# EAGLE design console (EAGLE 9.3.0)
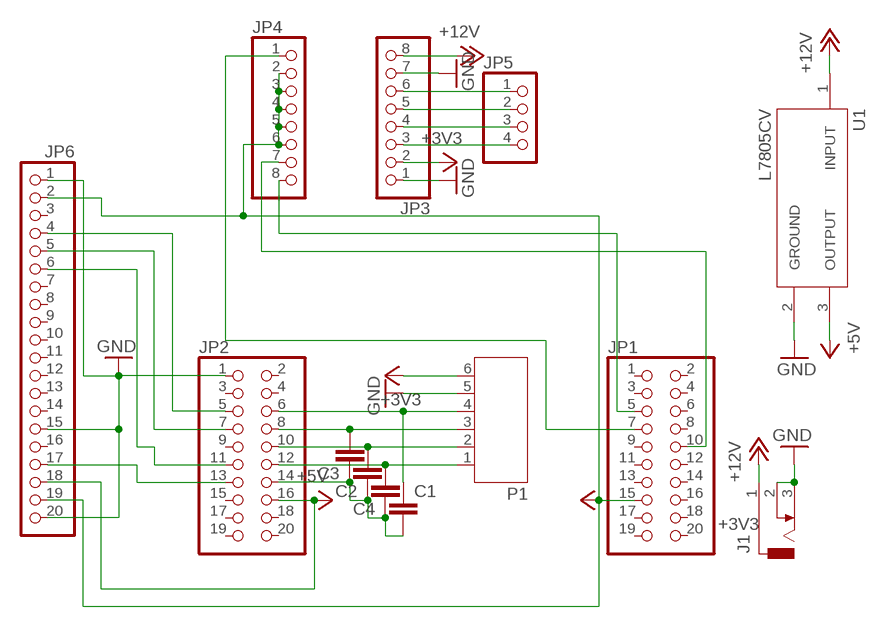
[diagram p0: schematic, sheet 1]

## Parts
C1  C-EU025-030X050  [C025-030X050]
C2  C-EU025-030X050  [C025-030X050]
C3  C-EU025-030X050  [C025-030X050]
C4  C-EU025-030X050  [C025-030X050]
J1  DCJ0303  [DCJ0303]
JP1  PINHD-2X10  [2X10]
JP2  PINHD-2X10  [2X10]
JP3  PINHD-1X8  [1X08]
JP4  PINHD-1X8  [1X08]
JP5  PINHD-1X4/90  [1X04/90]
JP6  PINHD-1X20  [1X20]
P1  JST-PH6  [JST-PH6]
U1  L7805CV  [TO255P1040X460X1968-3]

## Nets
+3V3: JP1.15 JP3.2 JP4.2 JP4.3 JP4.4 JP4.5 JP4.6 JP6.2 JP6.19 P1.6
+5V: JP2.16 JP6.18 U1.3(OUTPUT)
+12V: J1.1 JP3.8 U1.1(INPUT)
GND: J1.2 J1.3 JP2.1 JP3.1 JP3.7 JP6.1 JP6.15 JP6.20 P1.5 U1.2(GROUND)
N$1: C2.2 JP2.10 P1.2
N$2: C3.2 JP2.8 P1.3
N$3: C1.1 JP2.6 P1.4
N$4: JP2.5 JP6.4
N$5: JP2.13 JP6.17
N$6: JP2.7 JP6.5
N$7: C4.2 JP2.12 P1.1
N$8: JP1.7 JP4.1
N$9: JP3.6 JP5.1
N$10: JP1.10 JP4.7
N$11: JP1.5 JP4.8
N$12: JP3.5 JP5.2
N$13: JP3.4 JP5.3
N$14: JP3.3 JP5.4
N$15: C1.2 C2.1 C3.1 C4.1 JP2.14
N$16: JP2.11 JP6.6
Unconnected: JP1.1 JP1.2 JP1.3 JP1.4 JP1.6 JP1.8 JP1.9 JP1.11 JP1.12 JP1.13 JP1.14 JP1.16 JP1.17 JP1.18 JP1.19 JP1.20 JP2.2 JP2.3 JP2.4 JP2.9 JP2.15 JP2.17 JP2.18 JP2.19 JP2.20 JP6.3 JP6.7 JP6.8 JP6.9 JP6.10 JP6.11 JP6.12 JP6.13 JP6.14 JP6.16

## Library data of the parts
C1-C4 = rcl:C-EU: CAPACITOR, European symbol; SPICEPREFIX: C
J1 = con-jack:DCJ0303: DC POWER JACK Source: DCJ0303.pdf; OC_FARNELL: unknown; OC_NEWARK: unknown
JP1 JP2 = pinhead:PINHD-2X10: PIN HEADER
JP3 JP4 = pinhead:PINHD-1X8: PIN HEADER
JP5 = pinhead:PINHD-1X4: PIN HEADER
JP6 = pinhead:PINHD-1X20: PIN HEADER
P1 = jst-ph:JST-PH6
U1 = L7805CV:L7805CV: Standard Regulator Pos 5V 1.5A 3-Pin(3+Tab) TO-220 Standard Regulator Pos 5V 1.5A 3-Pin(3+Tab) TO-220; AVAILABILITY: Unavailable; DESCRIPTION: Linear Voltage Regulator IC 1 Output 1.5A TO-220; MF: STMicroelectronics; MP: L7805CV; PACKAGE: TO-220 STMicroelectronics; PRICE: None

## Board
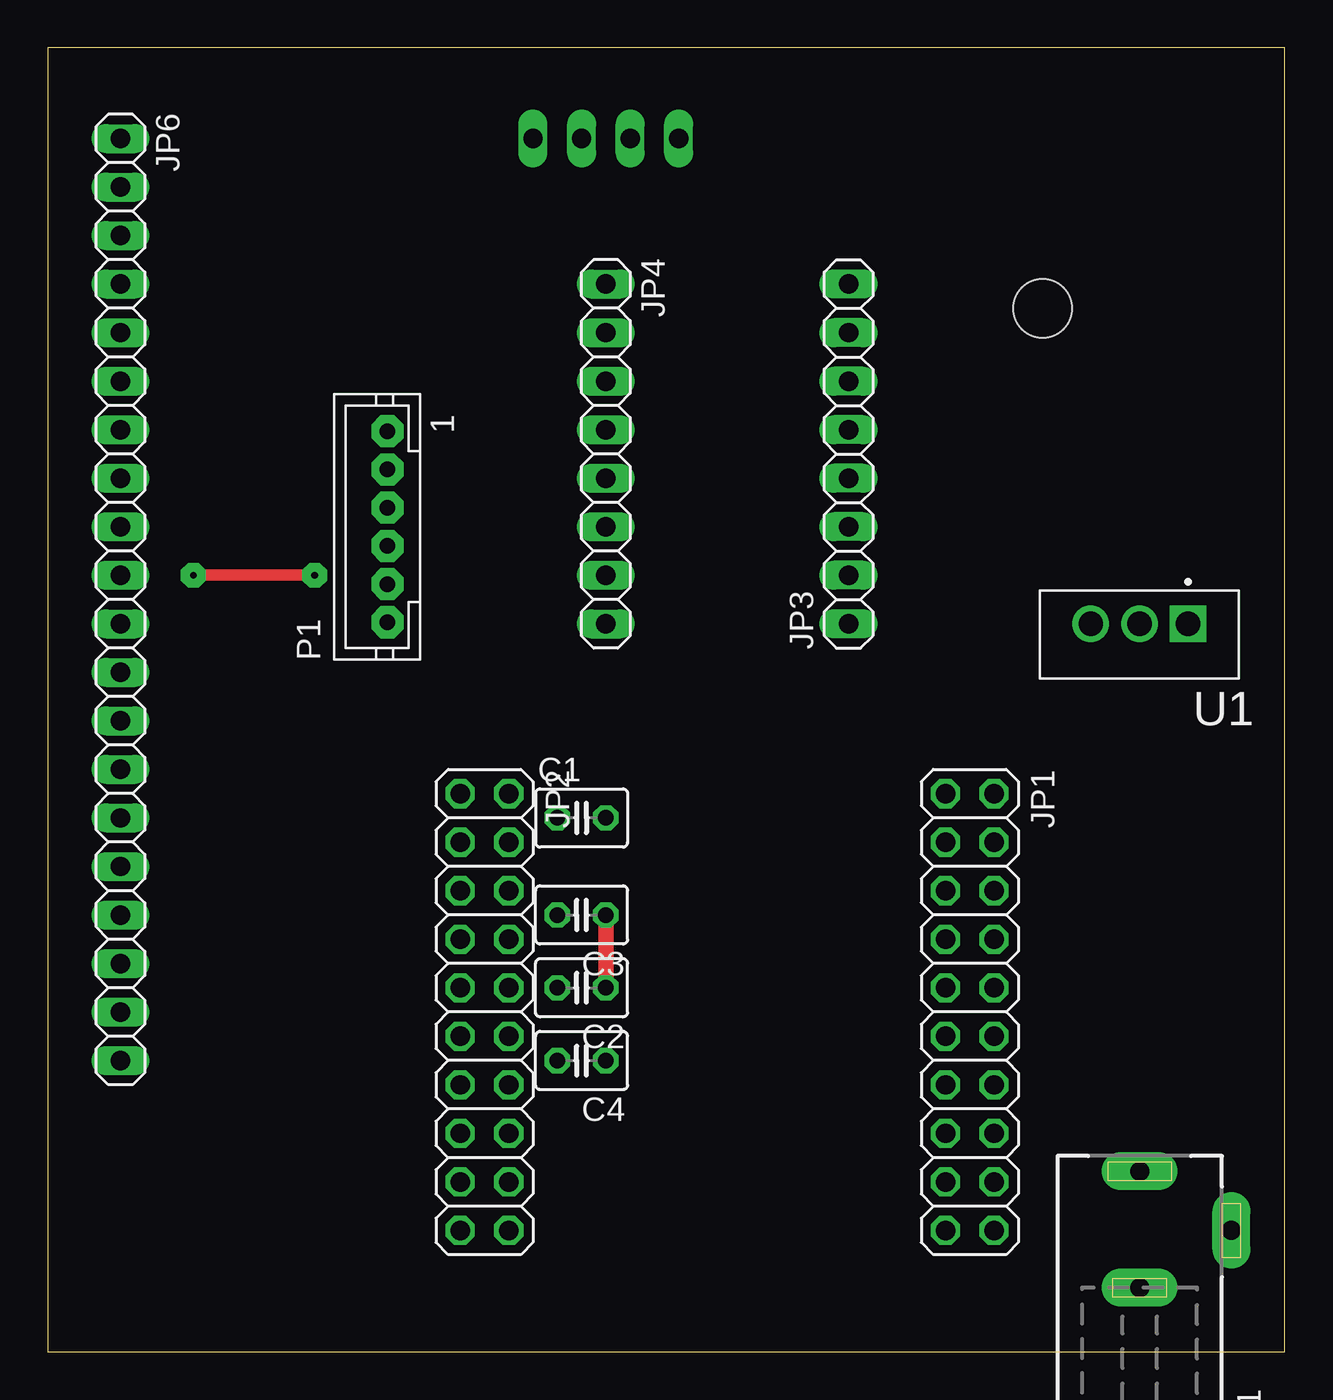
[diagram p1: board, top side]
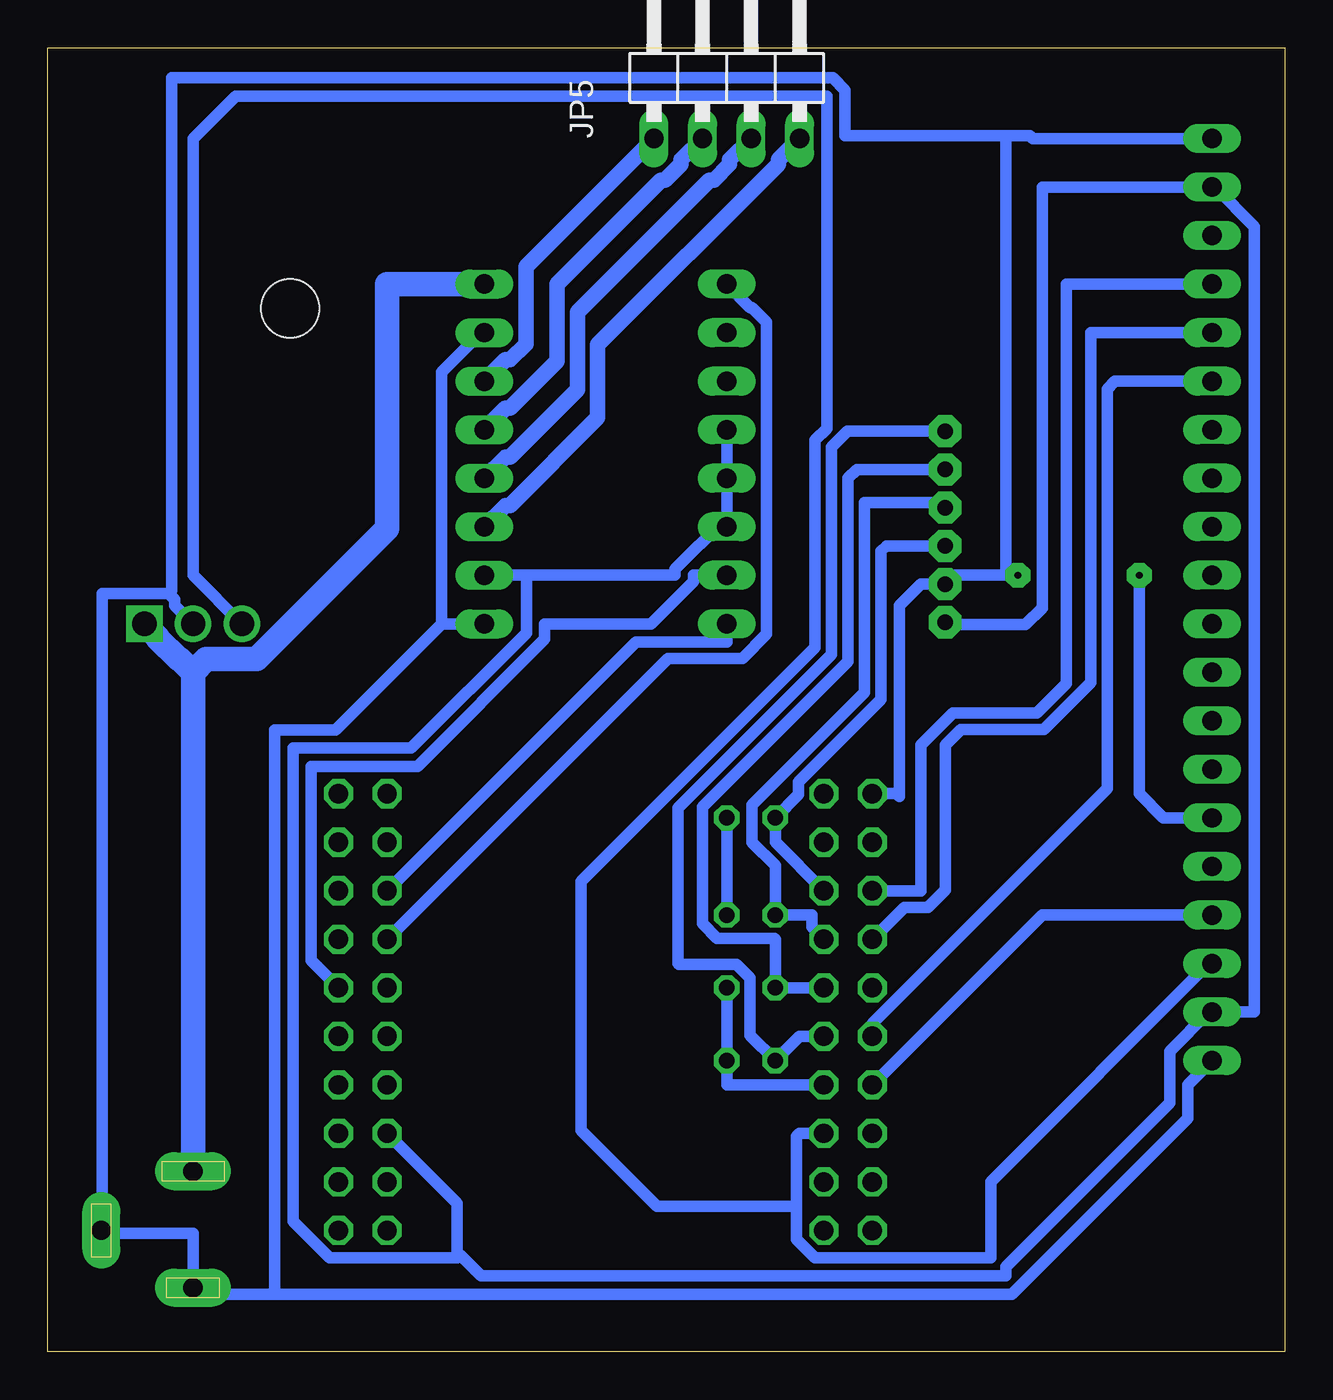
[diagram p2: board, bottom side, seen from below]

Size 64.75 x 68.25 mm. Coordinates in mm from the lower left corner, seen from the top.
Outline: 0,0 64.75,0 64.75,68.25 0,68.25 0,0
Copper layers (1*16): Top 0.035mm / dielectric 1.5mm / Bottom 0.035mm
Design rules "default *": minimum track width 24mil, minimum drill 0.35mm, track to track 10mil, track to pad 10mil, pad to pad 6mil, via to via 6mil, smd to smd 6mil, copper to edge 40mil, drill to drill 6mil, minimum pad ring 10mil, minimum via ring 8mil, stop-mask expansion 4mil, vias tented up to drill 0mil, thermal gap 10mil
Holes 3.05 mm at 52.07,54.61

### Footprints (pad centres in the part's own frame; a part is rotated, then mirrored left to right if it is on the bottom)
C025-030X050 = drill 0.813 octagon: 1 -1.27,0; 2 1.27,0
DCJ0303 = drill 1 pad 2 long: 1 0,3.1; 2 4.8,0; 3 0,-3
2X10 = drill 1.016 octagon: 1 -11.43,-1.27; 2 -11.43,1.27; 3 -8.89,-1.27; 4 -8.89,1.27; 5 -6.35,-1.27; 6 -6.35,1.27; 7 -3.81,-1.27; 8 -3.81,1.27; 9 -1.27,-1.27; 10 -1.27,1.27; 11 1.27,-1.27; 12 1.27,1.27; 13 3.81,-1.27; 14 3.81,1.27; 15 6.35,-1.27; 16 6.35,1.27; 17 8.89,-1.27; 18 8.89,1.27; 19 11.43,-1.27; 20 11.43,1.27
1X08 = drill 1.016 long: 1 -8.89,0; 2 -6.35,0; 3 -3.81,0; 4 -1.27,0; 5 1.27,0; 6 3.81,0; 7 6.35,0; 8 8.89,0
1X04/90 = drill 1.016 long: 1 -3.81,-3.81; 2 -1.27,-3.81; 3 1.27,-3.81; 4 3.81,-3.81
1X20 = drill 1.016 long: 1 -24.13,0; 2 -21.59,0; 3 -19.05,0; 4 -16.51,0; 5 -13.97,0; 6 -11.43,0; 7 -8.89,0; 8 -6.35,0; 9 -3.81,0; 10 -1.27,0; 11 1.27,0; 12 3.81,0; 13 6.35,0; 14 8.89,0; 15 11.43,0; 16 13.97,0; 17 16.51,0; 18 19.05,0; 19 21.59,0; 20 24.13,0
JST-PH6 = drill 0.813 pad 1.676 octagon: 1 5,0; 2 3,0; 3 1,0; 4 -1,0; 5 -3,0; 6 -5,0
TO255P1040X460X1968-3 = drill 1.27 pad 1.91 square: 1 0,0 | drill 1.27 pad 1.91: 2 2.55,0; 3 5.1,0

### Placement (x,y rotation side)
C1  27.94,27.94 0 top
C2  27.94,19.05 180 top
C3  27.94,22.86 180 top
C4  27.94,15.24 180 top
J1  57.15,6.35 0 top
JP1  48.26,17.78 270 top
JP2  22.86,17.78 270 top
JP3  41.91,46.99 90 top
JP4  29.21,46.99 270 top
JP5  29.21,67.31 0 bottom
JP6  3.81,39.37 270 top
P1  17.78,43.18 90 top
U1  59.69,38.1 180 top

### Tracks (layer width: path | path; a pad name or v marks a point on that pad's centre or on a via)
+3V3
  Bottom 0.61: 39.69,40.64 31.91,40.64 31.91,40.96 29.37,43.5 JP4.6 JP4.5 JP4.4 | 39.69,40.64 JP3.2 | 39.69,40.64 39.69,37.62 45.72,31.59 51.91,31.59 51.91,6.83 50.01,4.92 43.34,4.92 | 43.34,4.92 43.18,5.08 42.07,3.97 14.61,3.97 14.61,4.45 6.03,13.02 6.03,15.72 3.97,17.78 JP6.19 1.59,17.78 1.59,58.9 3.65,60.96 JP6.2 12.7,60.96 12.7,38.93 13.58,38.05 17.65,38.05 P1.6 | 43.34,4.92 43.34,7.78 JP1.15
+5V
  Bottom 0.61: JP2.16 25.4,11.43 25.56,11.27 25.56,7.62 | 25.56,7.62 25.56,5.87 24.61,4.92 15.4,4.92 15.4,8.89 3.97,20.32 JP6.18 | 25.56,7.62 32.86,7.62 36.83,11.59 36.83,24.61 24.59,36.85 24.59,47.7 23.97,48.32 23.97,65.72 54.93,65.72 57.15,63.5 57.15,40.66 U1.3
+12V
  Bottom 1.27: J1.1 57.15,35.56 | 57.15,35.56 57.85,36.26 57.9,36.26 58.98,37.34 58.98,37.39 U1.1 | 57.15,35.56 56.45,36.26 53.83,36.26 46.99,43.09 46.99,55.88 JP3.8
GND  (via drill 0.35 pad 1.3)
  Top 0.61: v13.97,40.64 v7.62,40.64
  Bottom 0.61: JP2.1 20.32,29.21 20.16,29.05 20.16,39.07 19.05,40.18 P1.5 17.32,40.64 v13.97,40.64 14.61,40.64 14.61,63.66 | JP6.1 13.18,63.5 13.34,63.66 14.61,63.66 | 58.42,39.69 58.1,39.37 58.1,39.05 U1.2 | 58.42,39.69 61.91,39.69 61.91,6.35 J1.2 61.75,6.19 57.15,6.19 J1.3 57.15,3.02 52.86,3.02 | 44.13,38.1 JP3.1 | 44.13,38.1 44.13,51.28 42.07,53.34 JP3.7 | JP6.20 5.08,13.97 5.08,12.22 14.29,3.02 52.86,3.02 | 44.13,38.1 49.69,32.54 52.86,32.54 52.86,3.02 | 14.61,63.66 23.02,63.66 23.02,66.04 23.65,66.67 58.26,66.67 58.26,39.85 58.42,39.69 | JP6.15 6.35,27.94 7.62,29.21 v7.62,40.64
N$1
  Bottom 0.61: JP2.10 C2.2 26.67,21.59 26.72,21.64 29.71,21.64 30.48,22.41 30.48,28.51 22.86,36.13 22.86,45.72 22.4,46.18 P1.2
N$2
  Bottom 0.61: JP2.8 24.77,22.23 24.77,22.86 C3.2 26.67,25.45 27.89,26.67 27.89,28.61 22,34.51 22,44.45 18.05,44.45 P1.3
N$3
  Bottom 0.61: JP2.6 26.67,26.67 C1.1 25.45,29.16 25.45,29.83 21.13,34.15 21.13,41.91 20.86,42.18 P1.4
N$4
  Bottom 0.61: JP6.4 11.43,55.88 11.43,34.97 12.98,33.43 17.37,33.43 19.05,31.75 19.05,24.13 JP2.5
N$5
  Bottom 0.61: JP2.13 12.7,22.86 JP6.17
N$6
  Bottom 0.61: JP2.7 19.91,23.27 18.69,23.27 17.78,24.18 17.78,31.75 16.97,32.56 12.62,32.56 10.16,35.02 10.16,53.34 JP6.5
N$7
  Bottom 0.61: JP2.12 25.4,16.51 C4.2 27.99,16.56 27.99,19.55 28.7,20.27 31.7,20.27 31.75,20.32 31.75,28.46 23.72,36.49 23.72,47.35 22.89,48.18 P1.1
N$8
  Bottom 0.61: JP4.1 27.99,54.66 27.9,54.66 27.13,53.89 27.13,37.55 28.4,36.28 32.3,36.28 JP1.7
N$9
  Bottom 0.813: JP3.6 40.79,51.92 40.56,51.92 39.73,52.75 39.73,56.79 JP5.1
N$10
  Bottom 0.61: JP4.7 30.96,40.64 30.96,40.32 33.18,38.1 38.73,38.1 38.73,37.31 45.4,30.64 50.96,30.64 50.96,20.48 JP1.10
N$11
  Bottom 0.61: JP1.5 33.97,37.15 29.21,37.15 JP4.8
N$12
  Bottom 0.813: JP5.2 31.6,62.38 31.6,62.15 32.43,61.32 32.66,61.32 38.1,55.88 38.1,51.84 40.56,49.38 40.79,49.38 JP3.5
N$13
  Bottom 0.813: JP3.4 40.79,46.84 40.56,46.84 37.03,50.36 37.03,54.41 30.12,61.32 29.89,61.32 29.06,62.15 29.06,62.38 JP5.3
N$14
  Bottom 0.813: JP5.4 26.52,62.38 26.52,62.15 35.97,52.7 35.97,48.89 40.56,44.3 40.79,44.3 JP3.3
N$15
  Top 0.813: C3.1 C2.1
  Bottom 0.61: C1.2 C3.1 | JP2.14 29.21,13.97 C4.1 C2.1
N$16
  Bottom 0.61: JP6.6 8.89,50.8 9.3,50.39 9.3,29.48 21.59,17.18 JP2.11